# Altium schematic sheet B38_Relay.SchDoc
size 558 x 431 mm
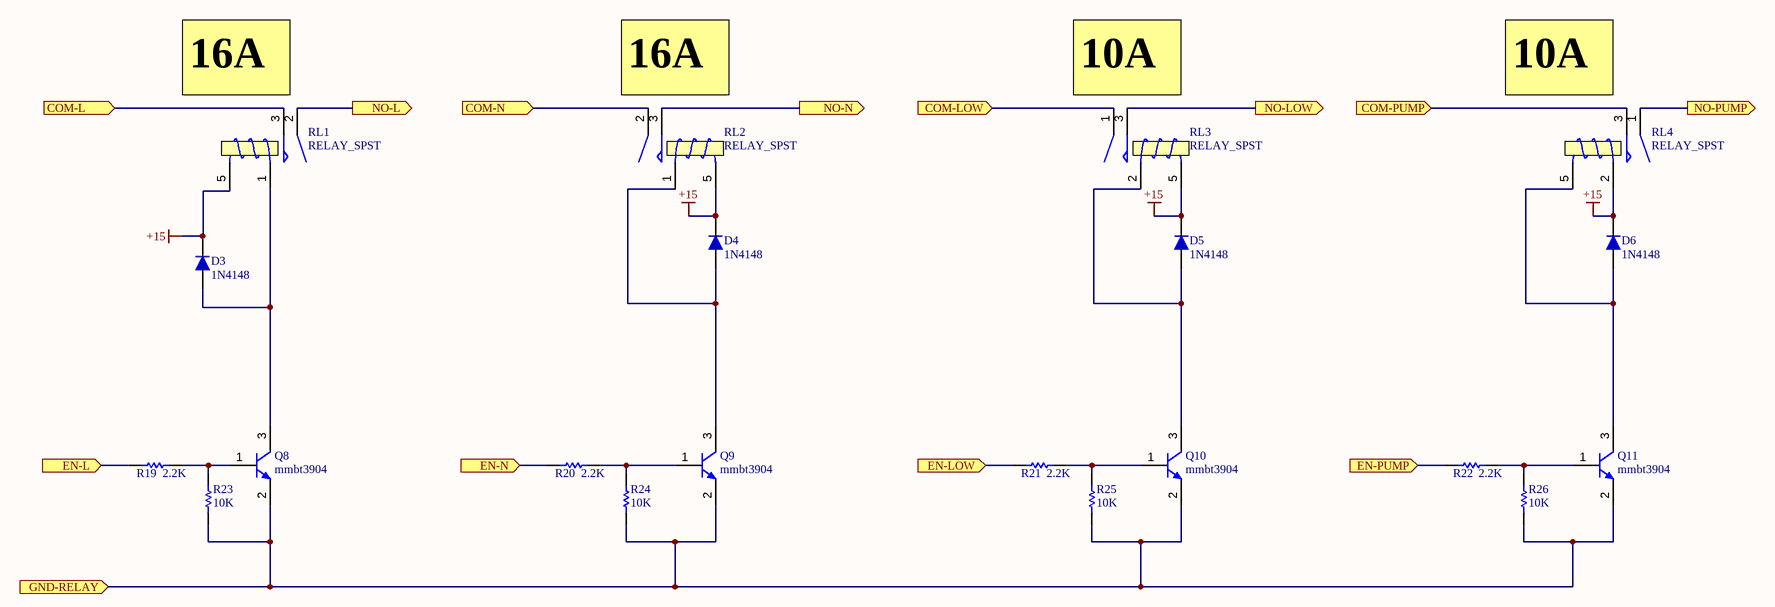
[diagram p0: B38_Relay.SchDoc]

## Parts
D3  1N4148  [SOD-123]
D4  1N4148  [SOD-123]
D5  1N4148  [SOD-123]
D6  1N4148  [SOD-123]
Q8  mmbt3904  [SOT-23]
Q9  mmbt3904  [SOT-23]
Q10  mmbt3904  [SOT-23]
Q11  mmbt3904  [SOT-23]
R19  2.2K  [RES0603]
R20  2.2K  [RES0603]
R21  2.2K  [RES0603]
R22  2.2K  [RES0603]
R23  10K  [RES0603]
R24  10K  [RES0603]
R25  10K  [RES0603]
R26  10K  [RES0603]
RL1  RELAY_SPST  [RELAY-HF115F]
RL2  RELAY_SPST  [RELAY-HF115F]
RL3  RELAY_SPST  [REL-SEDNA-4PIN]
RL4  RELAY_SPST  [REL-SEDNA-4PIN]

## Ports
COM-L (in), COM-LOW (in), COM-N (in), COM-PUMP (in), EN-L (in), EN-LOW (in), EN-N (in), EN-PUMP (in), GND-RELAY (in), NO-L (out), NO-LOW (out), NO-N (out), NO-PUMP (out)

## Nets
+15: D3.2 D4.2 D5.2 D6.2 RL1.5(T2) RL2.5(T2) RL3.5(T2) RL4.2(T1)
COM-L: RL1.3(NO) ; port COM-L
COM-LOW: RL3.1(COM) ; port COM-LOW
COM-N: RL2.2(COM) ; port COM-N
COM-PUMP: RL4.3(NO) ; port COM-PUMP
EN-L: R19.2 ; port EN-L
EN-LOW: R21.2 ; port EN-LOW
EN-N: R20.2 ; port EN-N
EN-PUMP: R22.2 ; port EN-PUMP
GND-RELAY: Q8.2(E) Q9.2(E) Q10.2(E) Q11.2(E) R23.2 R24.2 R25.2 R26.2 ; port GND-RELAY
NO-L: RL1.2(COM) ; port NO-L
NO-LOW: RL3.3(NO) ; port NO-LOW
NO-N: RL2.3(NO) ; port NO-N
NO-PUMP: RL4.1(COM) ; port NO-PUMP
NetD3_1: D3.1 Q8.3(C) RL1.1(T1)
NetD4_1: D4.1 Q9.3(C) RL2.1(T1)
NetD5_1: D5.1 Q10.3(C) RL3.2(T1)
NetD6_1: D6.1 Q11.3(C) RL4.5(T2)
NetQ8_1: Q8.1(B) R19.1 R23.1
NetQ9_1: Q9.1(B) R20.1 R24.1
NetQ10_1: Q10.1(B) R21.1 R25.1
NetQ11_1: Q11.1(B) R22.1 R26.1

## Notes on the sheet
- (near RL1) 16A
- (near RL2) 16A
- (near RL3) 10A
- (near RL4) 10A
- DWG. NO.
- REV.
- SHT.
- REVISION
- DESCRIPTION
- DATE
- APPROVED
- THIS DOCUMENT AND THE DATA DISCLOSED HEREIN OR HEREWITH IS THE PROPERTY OF ALTIUM LIMITED AND MAY BE FREELY DISTRIBUTED IN WHOLE. NO RIGHTS ARE RESERVED OR EXPRESS OR IMPLIED WARANTEE GIVEN.
- ENG:
- DSN:
- APPROVALS
- PROJECT
- DOCUMENT REVISION:
- DESIGN ITEM:
- CHK:
- BOM:
- REFERENCE DOCUMENTS
- PROJECT REVISION:
- TITLE
- FAB DWG:
- PCB DWG:
- ASSY DWG:
- SCALE:
- SIZE
- C
- CAGE CODE
- FILE NAME
- DWG NO.
- SHEET
- OF
- REV

## Library data of the parts
D3-D6 = 1N4148: DIODE GEN PURP 100V 200MA DO35; Published: 2017-1-12; PackageVersion: 2017-1-12; PackageReference: DO 35; Publisher: Abbas Basereh; PackageDescription: DIODE GEN PURP 100V 200MA DO35; ComponentLink1Description: Manufacturer Link; ComponentLink1URL: http://www.digikey.com/product-detail/en/fairchild-on-semiconductor/1N4148/1N4148FS-ND/458603; ComponentLink2Description: Datasheet; PART.NO: 1N4148
R19-R26 = Res1: Resistor 5%; Manufacturer: Panasonic; PN: ERJ3GEYJ102V; Value: 1KΩ